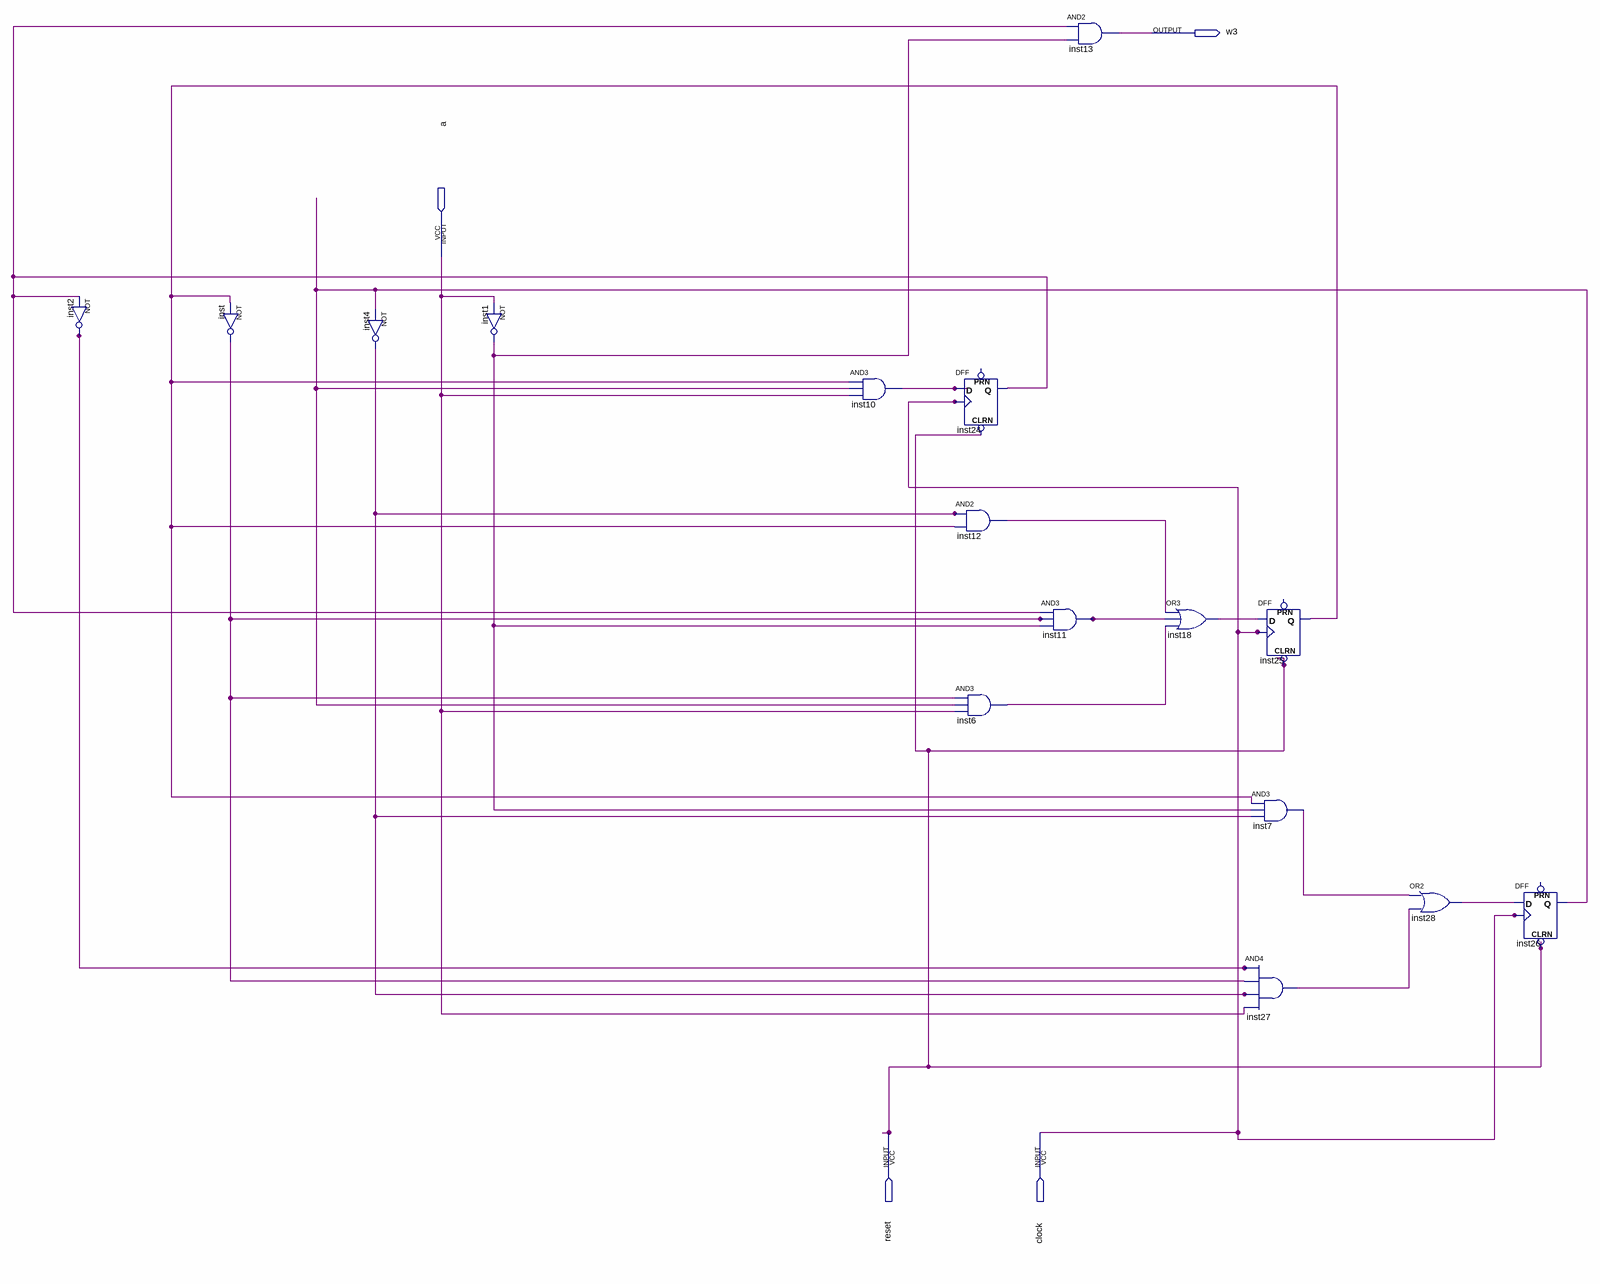
[diagram p0: schematic sheet]
// Quartus schematic mealy_first_part.bdf as structural Verilog: 16 symbols, 4 pins
module mealy_first_part (
  input  a,
  input  reset,
  input  clock,
  output w3
);

  wire inst1_out, inst2_out, inst4_out, inst6_out, inst7_out, inst10_out, inst11_out, inst12_out, inst18_out,
       inst24_q, inst25_q, inst26_q, inst27_out, inst28_out, inst_out;

  not inst2 (inst2_out, inst24_q);
  not inst (inst_out, inst25_q);
  not inst4 (inst4_out, inst26_q);
  not inst1 (inst1_out, a);
  and inst10 (inst10_out, inst25_q, inst26_q, a);
  DFF inst24 (.CLRN(reset), .CLK(clock), .D(inst10_out), .Q(inst24_q));  // open: PRN
  and inst12 (inst12_out, inst4_out, inst25_q);
  and inst6 (inst6_out, inst_out, inst26_q, a);
  and inst11 (inst11_out, inst24_q, inst_out, inst1_out);
  and inst13 (w3, inst24_q, inst1_out);
  or inst18 (inst18_out, inst12_out, inst11_out, inst6_out);
  DFF inst25 (.CLRN(reset), .CLK(clock), .D(inst18_out), .Q(inst25_q));  // open: PRN
  and inst7 (inst7_out, inst25_q, inst1_out, inst4_out);
  and inst27 (inst27_out, inst2_out, inst_out, inst4_out, a);
  or inst28 (inst28_out, inst7_out, inst27_out);
  DFF inst26 (.CLRN(reset), .CLK(clock), .D(inst28_out), .Q(inst26_q));  // open: PRN
endmodule
